# EasyEDA schematic 1-Schematic_ISM_WAVER.json
TITLE: Sheet_1; REV: 1.0; Date: 2022-12-25; Sheet: 1/1; Drawn By: maarnotto; Company: Your Company
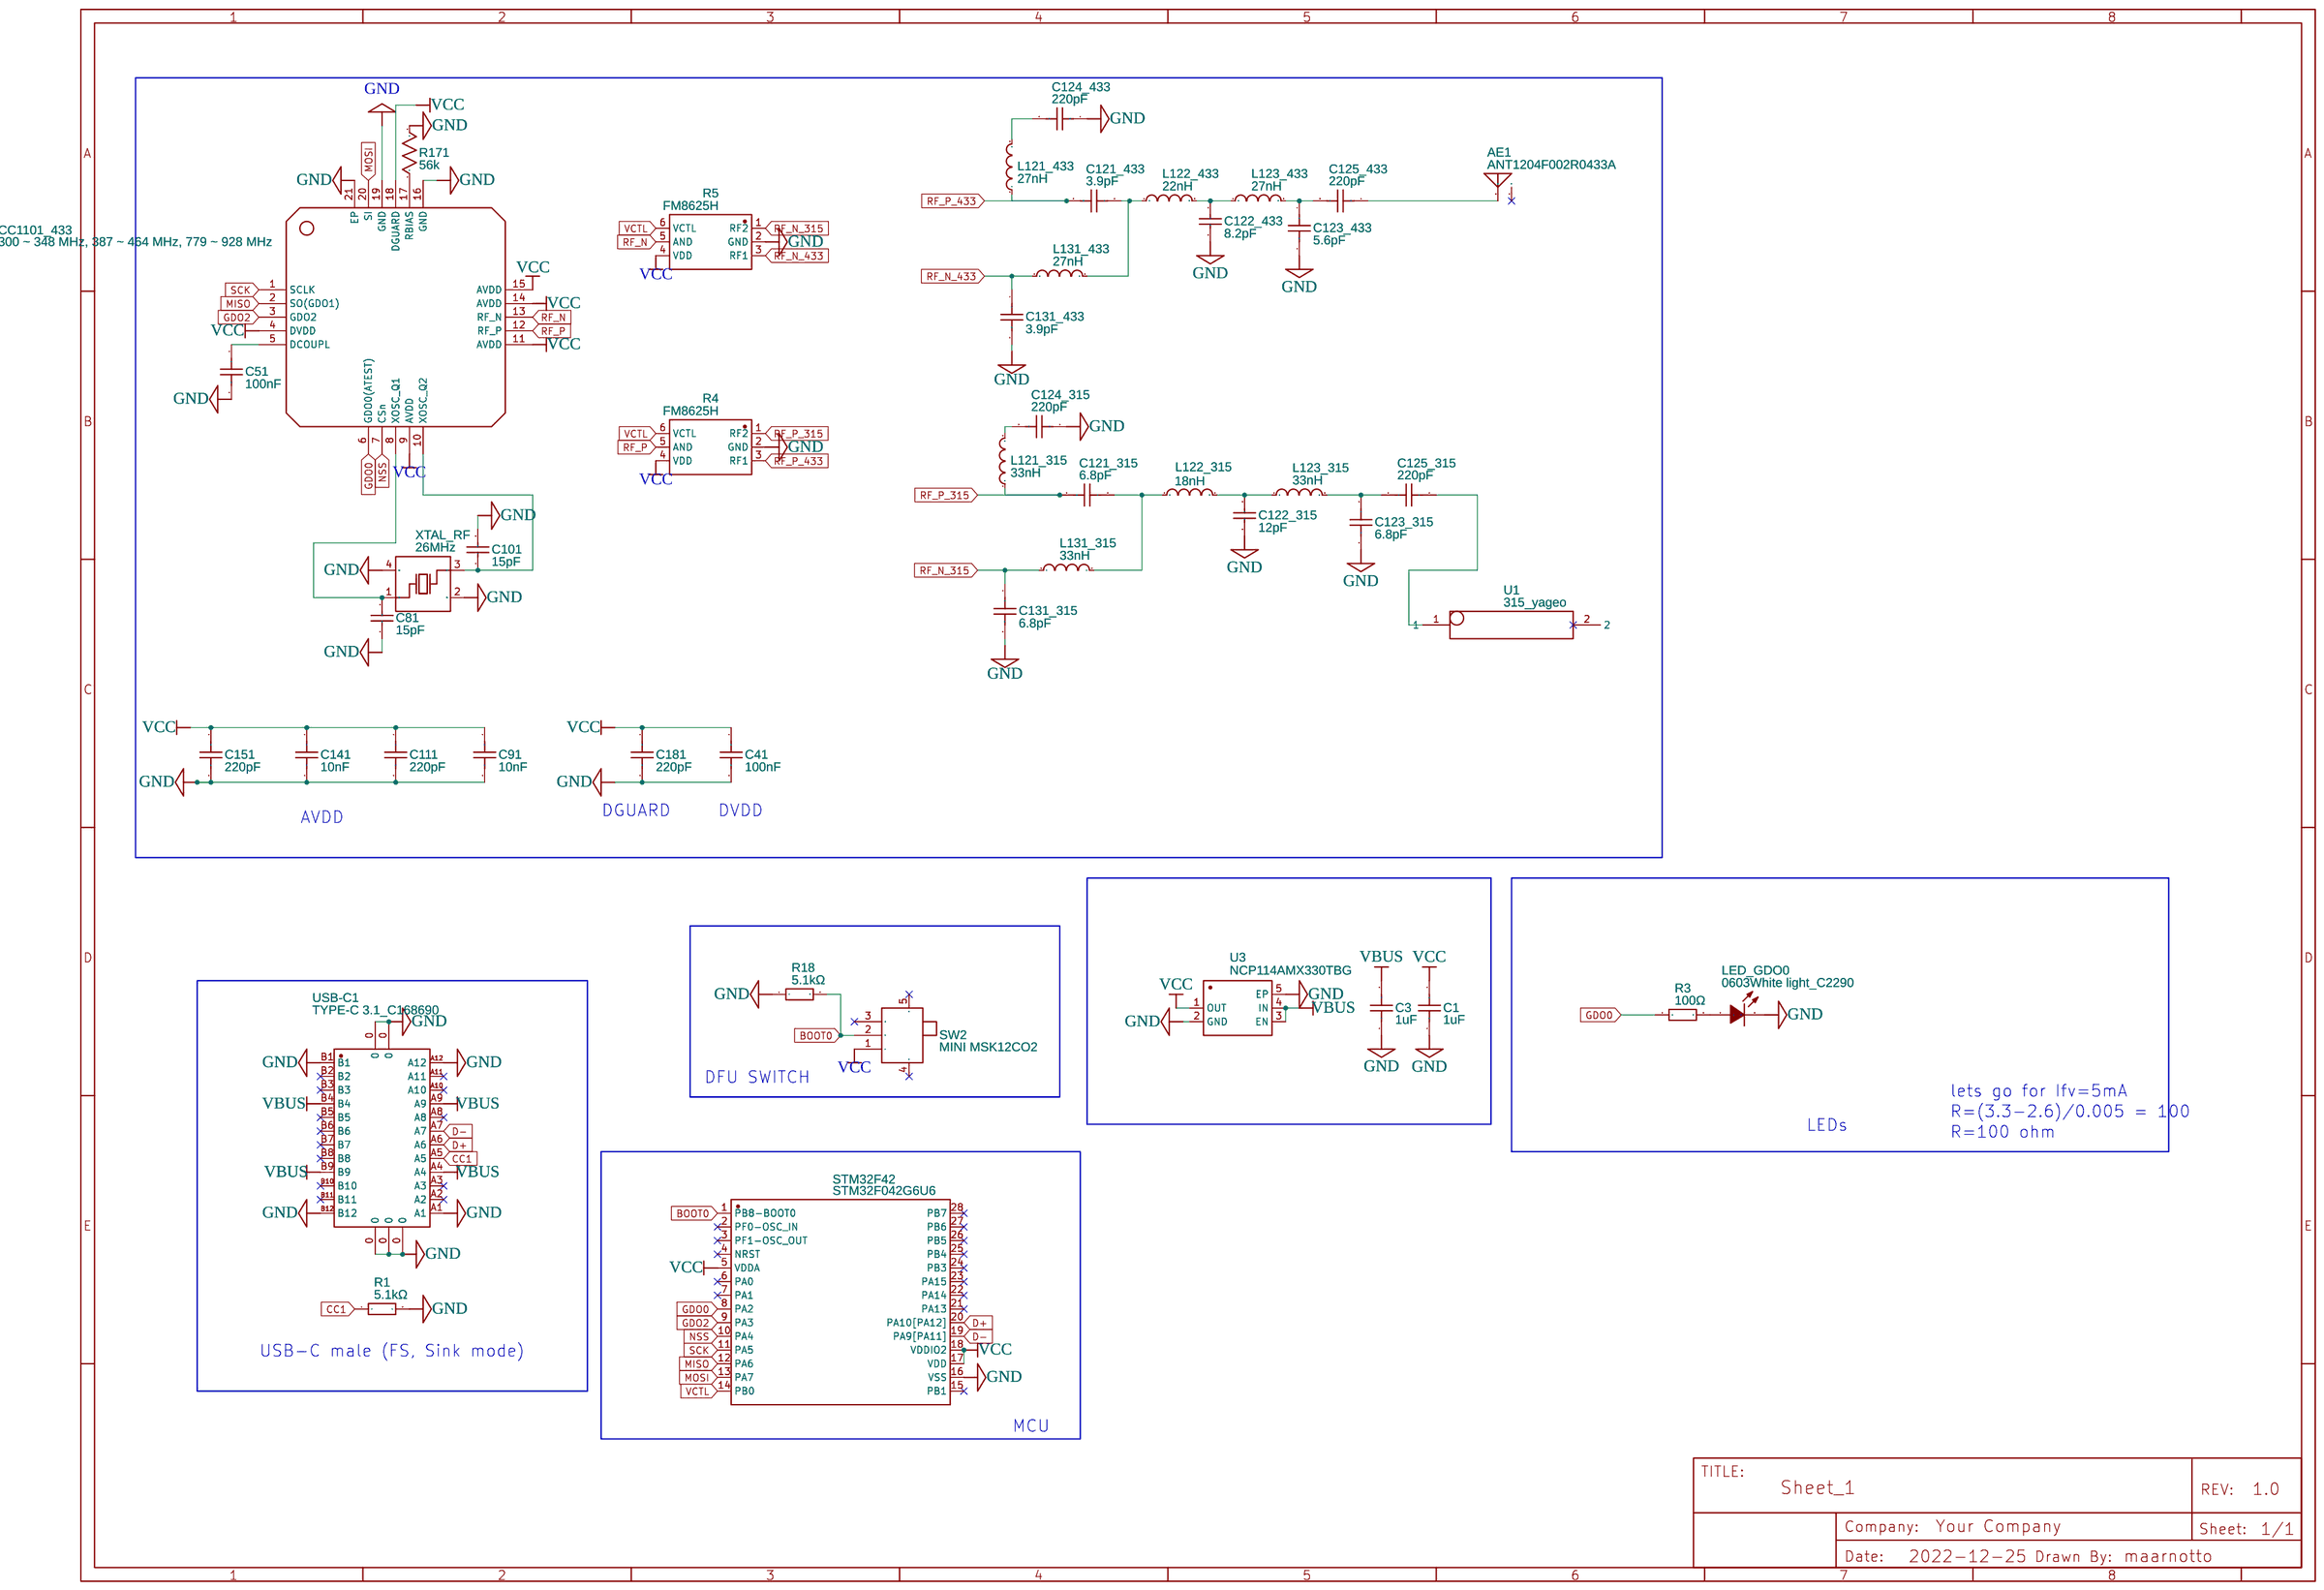
[diagram p0: schematic sheet]

## Parts
AE1  ANT1204F002R0433A  [ANT-SMD_L12.3-W4.0_ANT1204F002R0433A]
C1  1uF  [C0402]
C3  1uF  [C0402]
C41  100nF  [C0402]
C51  100nF  [C0402]
C81  15pF  [C0402]
C91  10nF  [C0402]
C101  15pF  [C0402]
C111  220pF  [C0402]
C121_315  6.8pF  [C0402]
C121_433  3.9pF  [C0402]
C122_315  12pF  [C0402]
C122_433  8.2pF  [C0402]
C123_315  6.8pF  [C0402]
C123_433  5.6pF  [C0402]
C124_315  220pF  [C0402]
C124_433  220pF  [C0402]
C125_315  220pF  [C0402]
C125_433  220pF  [C0402]
C131_315  6.8pF  [C0402]
C131_433  3.9pF  [C0402]
C141  10nF  [C0402]
C151  220pF  [C0402]
C181  220pF  [C0402]
CC1101_433  300 ~ 348 MHz, 387 ~ 464 MHz, 779 ~ 928 MHz  [QFN-20_L4.0-W4.0-P0.5-TL-EP]
L121_315  33nH  [L0402]
L121_433  27nH  [L0402]
L122_315  18nH  [L0402]
L122_433  22nH  [L0402]
L123_315  33nH  [L0402]
L123_433  27nH  [L0402]
L131_315  33nH  [L0402]
L131_433  27nH  [L0402]
LED_GDO0  0603White light_C2290  [LED0603-R-RD_WHITE]
R1  5.1kΩ  [R0402]
R3  100Ω  [R0603]
R4  FM8625H  [DFN-6_L1.1-W0.7-P0.40-BL]
R5  FM8625H  [DFN-6_L1.1-W0.7-P0.40-BL]
R18  5.1kΩ  [R0402]
R171  56k  [R0402]
STM32F42  STM32F042G6U6  [UFQFPN-28_L4.0-W4.0-P0.50-BL]
SW2  MINI MSK12CO2  [SW-SMD_MSK12CO2]
U1  315_yageo  [315_YAGEO]
U3  NCP114AMX330TBG  [UDFN-4_L1.0-W1.0-P0.65-BL-EP]
USB-C1  TYPE-C 3.1_C168690  [USB-C-SMD_TYPE-C-USB-3]
XTAL_RF  26MHz  [CRYSTAL-SMD_4P-L3.2-W2.5-BL]

## Library data of the parts
AE1 = ANT1204F002R0433A: Contributor: LCSC; Supplier: LCSC; Supplier Part: C141525; Manufacturer: YAGEO(国巨); JLCPCB Part Class: Extended Part
C1 C3 = C_0603_US: Contributor: LCEDA_Lib
C41 C51 C91 C111 C121_315 C121_433 C123_315 C123_433 C124_315 C124_433 C125_315 C125_433 C131_315 C131_433 C141 C151 C181 = C_0402_US: Contributor: LCEDA_Lib
C81 C101 = 0402CG150J500NT: Supplier: LCSC; Manufacturer: FH(风华); Supplier Part: C1548; JLCPCB Part Class: Basic Part
C122_315 C122_433 = 0402CG8R2C500NT: Supplier: LCSC; Manufacturer: FH(风华); Supplier Part: C1579; JLCPCB Part Class: Extended Part
CC1101_433 = CC1101RGPR: Supplier: LCSC; Manufacturer: TI(德州仪器); Supplier Part: C29953; JLCPCB Part Class: Extended Part
L121_315 L121_433 L122_315 L122_433 L123_315 L123_433 L131_315 L131_433 = L0402_US: Supplier Part: C14033; Contributor: LCEDA_Lib
LED_GDO0 = 0603White light_C2290: Supplier: LCSC; Manufacturer: KENTO; Manufacturer Part: KT-0603白灯; Supplier Part: C2290; JLCPCB Part Class: Basic Part
R1 R18 = 0402WGF5101TCE: Supplier: LCSC; Manufacturer: UNI-ROYAL(厚声); Supplier Part: C25905; JLCPCB Part Class: Basic Part
R3 = 0603WAF1000T5E: Supplier: LCSC; Manufacturer: UNI-ROYAL(厚声); Supplier Part: C22775; JLCPCB Part Class: Basic Part
R4 R5 = FM8625H: Contributor: LCSC; Supplier: LCSC; Supplier Part: C2857391; Manufacturer: FM(富满); JLCPCB Part Class: Extended Part
R171 = R_0402_US: Contributor: LCEDA_Lib
STM32F42 = STM32F042G6U6: Contributor: LCSC; Supplier: LCSC; Supplier Part: C961597; Manufacturer: ST(意法半导体); JLCPCB Part Class: Extended Part
SW2 = MINI MSK12CO2: Contributor: LCSC; Supplier: LCSC; Supplier Part: C2681570; Manufacturer: SHOU HAN(首韩); JLCPCB Part Class: Extended Part
U1 = 315_yageo: Manufacturer: PULSE ELECTRONICS; Manufacturer Part: ANT1204F002R0315A; Supplier: LCSC; Supplier Part: C3284059; link: https://jlcpcb.com/partdetail/PulseElectronics-ANT1204F002R0315A/C3284059; Contributor: maarnotto
U3 = NCP114AMX330TBG: Contributor: LCSC; Supplier: LCSC; Supplier Part: C603494; Manufacturer: onsemi(安森美); JLCPCB Part Class: Extended Part
USB-C1 = TYPE-C 3.1_C168690: Contributor: 立创EDA官方封装库; Supplier: LCSC; Supplier Part: C168690; Manufacturer: 精拓金; Manufacturer Part: 918-118A2021Y40000; JLCPCB Part Class: Extended Part
XTAL_RF = SMD-3225_4P26MHZ10PF10PPM-40&#126;+85℃: Contributor: LCSC; Supplier: LCSC; Supplier Part: C164046; Manufacturer: YJX(雅晶鑫); Manufacturer Part: TAXM26M4RDBCCT2T; JLCPCB Part Class: Extended Part

## Nets
GND: C1.1 C3.1 C41.2 C51.2 C81.1 C91.2 C101.2 C111.2 C122_315.1 C122_433.1 C123_315.2 C123_433.2 C124_315.1 C124_433.1 C131_315.2 C131_433.2 C141.2 C151.2 C181.2 CC1101_433.16(GND) CC1101_433.19(GND) CC1101_433.21(EP) LED_GDO0.2(K) R1.2 R4.2(GND) R5.2(GND) R18.1 R171.2 STM32F42.16(VSS) U3.2(GND) U3.5(EP) USB-C1.0 USB-C1.A1 USB-C1.A12 USB-C1.B1 USB-C1.B12 XTAL_RF.2(GND) XTAL_RF.4(GND)
VBUS: C3.2 U3.3(EN) U3.4(IN) USB-C1.A4 USB-C1.A9 USB-C1.B4 USB-C1.B9
VCC: C1.2 C41.1 C91.1 C111.1 C141.1 C151.1 C181.1 CC1101_433.4(DVDD) CC1101_433.9(AVDD) CC1101_433.11(AVDD) CC1101_433.14(AVDD) CC1101_433.15(AVDD) CC1101_433.18(DGUARD) R4.4(VDD) R5.4(VDD) STM32F42.5(VDDA) STM32F42.17(VDD) STM32F42.18(VDDIO2) SW2.1 U3.1(OUT)
BOOT0: R18.2 STM32F42.1(PB8-BOOT0) SW2.2
CC1: R1.1 USB-C1.A5
D+: STM32F42.20(PA10[PA12]) USB-C1.A6
D-: STM32F42.19(PA9[PA11]) USB-C1.A7
GDO0: CC1101_433.6(GDO0(ATEST)) R3.1 STM32F42.8(PA2)
GDO2: CC1101_433.3(GDO2) STM32F42.9(PA3)
MISO: CC1101_433.2(SO(GDO1)) STM32F42.12(PA6)
MOSI: CC1101_433.20(SI) STM32F42.13(PA7)
NSS: CC1101_433.7(CSn) STM32F42.10(PA4)
RF_N: CC1101_433.13(RF_N) R5.5(AND)
RF_N_315: C131_315.1 L131_315.1 R5.1(RF2)
RF_N_433: C131_433.1 L131_433.1 R5.3(RF1)
RF_P: CC1101_433.12(RF_P) R4.5(AND)
RF_P_315: C121_315.2 L121_315.1 R4.1(RF2)
RF_P_433: C121_433.2 L121_433.1 R4.3(RF1)
SCK: CC1101_433.1(SCLK) STM32F42.11(PA5)
VCTL: R4.6(VCTL) R5.6(VCTL) STM32F42.14(PB0)
Net-(AE1-S1): AE1.S1 C125_433.1
Net-(C51-1): C51.1 CC1101_433.5(DCOUPL)
Net-(C81-2): C81.2 CC1101_433.8(XOSC_Q1) XTAL_RF.1(OSC1)
Net-(C101-1): C101.1 CC1101_433.10(XOSC_Q2) XTAL_RF.3(OSC2)
Net-(C121_315-1): C121_315.1 L122_315.1 L131_315.2
Net-(C121_433-1): C121_433.1 L122_433.1 L131_433.2
Net-(C122_315-2): C122_315.2 L122_315.2 L123_315.1
Net-(C122_433-2): C122_433.2 L122_433.2 L123_433.1
Net-(C123_315-1): C123_315.1 C125_315.2 L123_315.2
Net-(C123_433-1): C123_433.1 C125_433.2 L123_433.2
Net-(C124_315-2): C124_315.2 L121_315.2
Net-(C124_433-2): C124_433.2 L121_433.2
Net-(C125_315-1): C125_315.1 U1.1
Net-(CC1101_433-17): CC1101_433.17(RBIAS) R171.1
Net-(LED_GDO0-1): LED_GDO0.1(A) R3.2

Not connected (* = marked no-connect by the designer): AE1 S2*; STM32F42 2(PF0-OSC_IN)* 3(PF1-OSC_OUT)* 4(NRST)* 6(PA0)* 7(PA1)* 15(PB1)* 21(PA13)* 22(PA14)* 23(PA15)* 24(PB3)* 25(PB4)* 26(PB5)* 27(PB6)* 28(PB7)*; SW2 3* 4* 5*; U1 2*; USB-C1 A2* A3* A8* A10* A11* B2* B3* B5* B6* B7* B8* B10* B11*

## Notes on the sheet
- DGUARD
- DVDD
- AVDD
- DFU SWITCH
- lets go for Ifv=5mA
- R=(3.3-2.6)/0.005 = 100
- LEDs
- R=100 ohm
- USB-C male (FS, Sink mode)
- MCU
